# Altium project TLSR8258_Module.PrjPcb
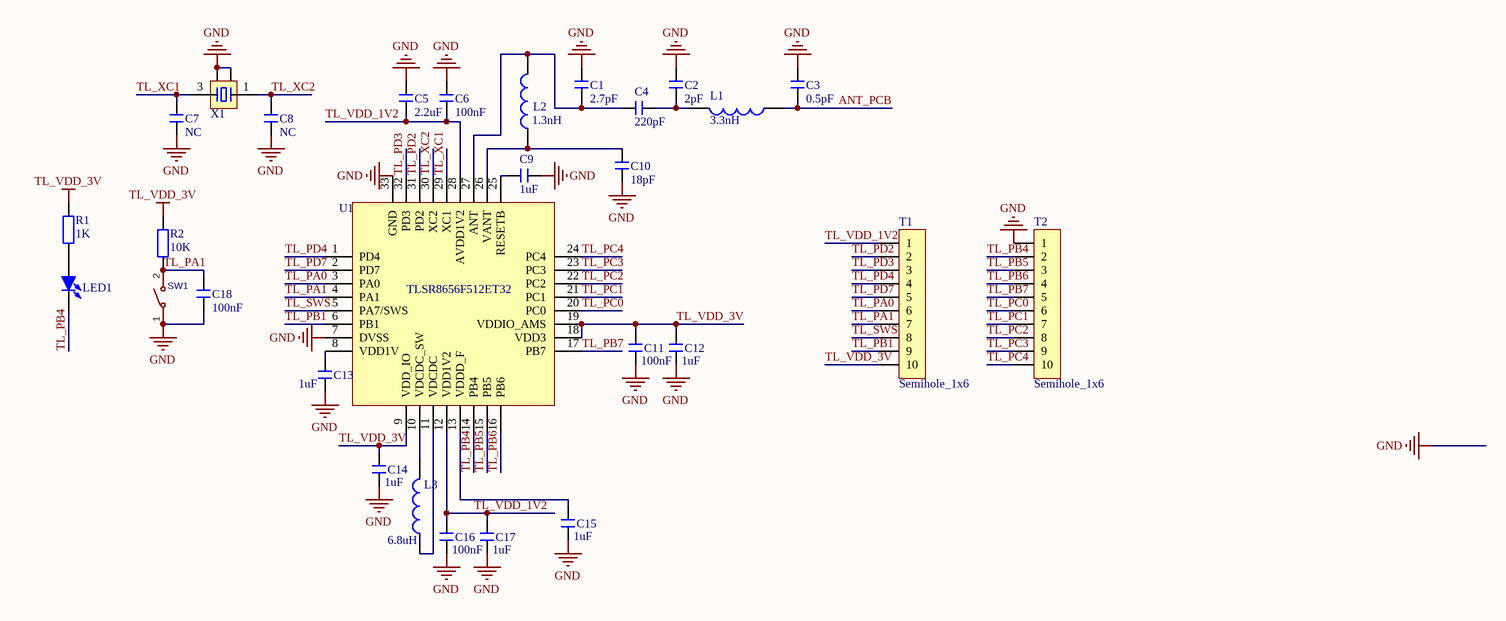
[diagram p0: TLSR8258_Module.SchDoc]
1 sheet, 29 parts. Net scope: global (net labels, ports and power ports of the same name join across sheets).
Board file: TLSR8258_Module.PcbDoc

## Sheet TLSR8258_Module.SchDoc
size A3; SheetNumber: 1; SheetTotal: 1

### Parts
C1  2.7pF  [C 0402_L]
C2  2pF  [C 0402_L]
C3  0.5pF  [C 0402_L]
C4  220pF  [C 0402_L]
C5  2.2uF  [C 0402_L]
C6  100nF  [C 0402_L]
C7  NC  [C 0402_L]
C8  NC  [C 0402_L]
C9  1uF  [C 0402_L]
C10  18pF  [C 0402_L]
C11  100nF  [C 0402_L]
C12  1uF  [C 0402_L]
C13  1uF  [C 0402_L]
C14  1uF  [C 0402_L]
C15  1uF  [C 0402_L]
C16  100nF  [C 0402_L]
C17  1uF  [C 0402_L]
C18  100nF  [C 0402_L]
L1  3.3nH  [L 0402]
L2  1.3nH  [L 0402]
L3  6.8uH  [L 0603]
LED1  LED  [LED0402-RD]  (value not drawn)
R1  1K  [R 0402_L]
R2  10K  [R 0402_L]
SW1  TS-1088R-02026  [SW-SMD_L3.9-W3.0-P4.45]  (value not drawn)
T1  Semihole_1x6  [SEMIHOLE_1x10]
T2  Semihole_1x6  [SEMIHOLE_1x10]
U1  TLSR8656F512ET32  [QFN32 5x5_L]
X1  TAXM24M4ZFBCCT2T  [OSC 3225-4P]  (value not drawn)

### Nets
GND: C1.1 C2.1 C3.1 C5.1 C6.1 C7.1 C8.1 C9.1 C10.2 C11.1 C12.1 C13.1 C14.1 C15.1 C16.1 C17.1 C18.1 SW1.1 T2.1 U1.7(DVSS) U1.33(GND) X1.2 X1.4
TL_VDD_3V: C11.2 C12.2 C14.2 R1.2 R2.2 T1.10 U1.9(VDD_IO) U1.18(VDD3) U1.19(VDDIO_AMS)
ANT_PCB: C3.2 L1.1
TL_PA0: T1.6 U1.3(PA0)
TL_PA1: C18.2 R2.1 SW1.2 T1.7 U1.4(PA1)
TL_PB1: T1.9 U1.6(PB1)
TL_PB4: LED1.1(K) T2.2 U1.14(PB4)
TL_PB5: T2.3 U1.15(PB5)
TL_PB6: T2.4 U1.16(PB6)
TL_PB7: T2.5 U1.17(PB7)
TL_PC0: T2.6 U1.20(PC0)
TL_PC1: T2.7 U1.21(PC1)
TL_PC2: T2.8 U1.22(PC2)
TL_PC3: T2.9 U1.23(PC3)
TL_PC4: T2.10 U1.24(PC4)
TL_PD2: T1.2 U1.31(PD2)
TL_PD3: T1.3 U1.32(PD3)
TL_PD4: T1.4 U1.1(PD4)
TL_PD7: T1.5 U1.2(PD7)
TL_SWS: T1.8 U1.5(PA7/SWS)
TL_VDD_1V2: C5.2 C6.2 C16.2 C17.2 T1.1 U1.12(VDD1V2) U1.28(AVDD1V2)
TL_XC1: C7.2 U1.29(XC1) X1.3
TL_XC2: C8.2 U1.30(XC2) X1.1
NetC1_2: C1.2 C4.1 L2.2 U1.27(ANT)
NetC2_2: C2.2 C4.2 L1.2
NetC9_2: C9.2 U1.25(RESETB)
NetC10_1: C10.1 L2.1 U1.26(VANT)
NetC13_2: C13.2 U1.8(VDD1V)
NetC15_2: C15.2 U1.13(VDDD_F)
NetL3_1: L3.1 U1.11(VDCDC)
NetL3_2: L3.2 U1.10(VDCDC_SW)
NetLED1_2: LED1.2(A) R1.1

### Library data of the parts
C1-C18 = C: 贴片电容
L1-L3 = L: 小功率贴片电感
R1 R2 = R: 贴片电阻
SW1 = TS-1088R-02026: 电路结构:单刀单掷;按钮形状:圆形按钮;作用力:2.6N;安装方式:立贴;开关长度:3.9mm;开关宽度:2.93mm;开关高度:2mm;带支架:不带支架;触点电流:50mA;额定电压:12V;带灯:-;工作寿命:10万次;; Manufacturer: XUNPU(讯普); AddInBom: yes; ModelId: b26698b69f274ffabef8a26c7d0e5dd1聨0819f05c4eef4c71ace90d822a990e87; ModelName: SW-SMD_L3.9-W2.9-H2.0-LS4.8; ModelTransform: 188.976,114.174,0,0,0,0,0,0,0; Circuit: 单刀单掷; Actuator Style: 圆形按钮; Operating Force: 2.6N; Switch Height: 2mm; with Bracket: 不带支架; Contact Current: 50mA; Voltage Rating: 12V; Actuator/Cap Color: 黑色; Life: 10万次; Symbol: TS-1088R-02026; Device: TS-1088R-02026; LCSC Part Name: 3.9*2.93*2mm 立贴 轻触开关; SupplierPart: C455280; ManufacturerPart: TS-1088R-02026; Supplier Footprint: SMD,4x3mm; JLCPCB Part Class: Extended Part; Datasheet: https://item.szlcsc.com/datasheet/TS-1088R-02026/457635.html; Supplier: LCSC; ConvertToPcb: yes; FootprintName: SW-SMD_L3.9-W3.0-P4.45; Mounting Type: 立贴; Length: 3.9mm; Width: 2.93mm; With Lamp: -; Termination Style: SMD接片
T1 T2 = Semihole_1x10
X1 = XTAL-4P: 4脚无源晶振(24M)